# Altium project SynchronousRectifier.PrjPcb
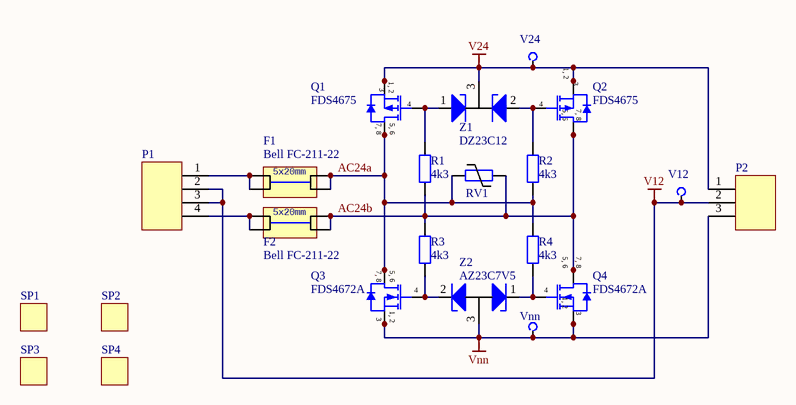
[diagram p0: SynchronousRectifier.SchDoc]
Version: 1.0
1 sheet, 22 parts. Net scope: global (net labels, ports and power ports of the same name join across sheets).
Board file: SynchronousRectifier_ASCII.PcbDoc

## Sheet SynchronousRectifier.SchDoc
size A; SheetNumber: 1; SheetTotal: 1

### Parts
F1  Bell FC-211-22  [FUSE_CLIP_5x20]
F2  Bell FC-211-22  [FUSE_CLIP_5x20]
P1  Terminal4_5.08mm  [MOLEX-39544-3004]  (value not drawn)
P2  Terminal3_5.08mm  [MOLEX-39544-3003]  (value not drawn)
Q1  FDS4675  [SO-8_M]
Q2  FDS4675  [SO-8_M]
Q3  FDS4672A  [SO-8_M]
Q4  FDS4672A  [SO-8_M]
R1  4k3  [CR1608-0603_N]
R2  4k3  [CR1608-0603_N]
R3  4k3  [CR1608-0603_N]
R4  4k3  [CR1608-0603_N]
RV1  V33MLA1206NHAUTO  [VR3216-1206]  (value not drawn)
SP1  Spacer-3mm-tapped x 10mm  [Spacer-3mm tapped x 10 mm]  (value not drawn)
SP2  Spacer-3mm-tapped x 10mm  [Spacer-3mm tapped x 10 mm]  (value not drawn)
SP3  Spacer-3mm-tapped x 10mm  [Spacer-3mm tapped x 10 mm]  (value not drawn)
SP4  Spacer-3mm-tapped x 10mm  [Spacer-3mm tapped x 10 mm]  (value not drawn)
V12  Power 12V FWR  [PCBPIN - 0.7mm]  (value not drawn)  (no BOM)
V24  Power 24V FWR  [PCBPIN - 0.7mm]  (value not drawn)  (no BOM)
Vnn  Power Ground  [PCBPIN - 0.7mm]  (value not drawn)  (no BOM)
Z1  DZ23C12  [SOT23_M]
Z2  AZ23C7V5  [SOT23_M]

### Nets
V12: P1.2 P1.3 P2.2 V12.1(TP)
V24: P2.1 Q1.1(S) Q1.2(S) Q1.3(S) Q2.1(S) Q2.2(S) Q2.3(S) V24.1(TP) Z1.3(K)
Vnn: P2.3 Q3.1(S) Q3.2(S) Q3.3(S) Q4.1(S) Q4.2(S) Q4.3(S) Vnn.1(TP) Z2.3(K)
AC24a: F1.2 F1.2a Q1.5(D) Q1.6(D) Q1.7(D) Q1.8(D) Q3.5(D) Q3.6(D) Q3.7(D) Q3.8(D) R2.1 R4.2 RV1.2
AC24b: F2.2 F2.2a Q2.5(D) Q2.6(D) Q2.7(D) Q2.8(D) Q4.5(D) Q4.6(D) Q4.7(D) Q4.8(D) R1.1 R3.2 RV1.1
NetF1_1: F1.1 F1.1a P1.1
NetF2_1: F2.1 F2.1a P1.4
NetQ1_4: Q1.4(G) R1.2 Z1.1(A1)
NetQ2_4: Q2.4(G) R2.2 Z1.2(A2)
NetQ3_4: Q3.4(G) R3.1 Z2.2(A2)
NetQ4_4: Q4.4(G) R4.1 Z2.1(A1)

### Notes on the sheet
- (in symbol FDS4672A) 7, 8; 5, 6; 1, 2
- (in symbol FDS4675) 1, 2; 7, 8; 5, 6
- (in symbol FUSE_CLIP_5x20) 5x20mm

### Library data of the parts
F1 F2 = FUSE_CLIP_5x20: 5x20mm fuse clip PCB Mount; Value: 10 A; Digikey: 507-1415-ND
P1 = Terminal4_5.08mm: MULTICOMP MC24368 TERMINAL BLOCK EUROSTYLE, 4 POSITION, 26-12AWG, 5.08mm; Farnell PN: 1624302; LCSC: *
P2 = Terminal3_5.08mm: MULTICOMP MC24367 TERMINAL BLOCK EUROSTYLE, 3 POSITION, 26-12AWG, 5.08mm; Farnell PN: *; LCSC: *
Q1 Q2 = FDS4675: P-Channel Power MOSFET, 11 A, 40 V, RDS(ON) = 0.013 ohm @ VGS = -10   VRDS(ON) = 0.017 ohm @ VGS =   -4.5 VC; Manufacturer: Fairchild Semiconductor; Package Version: Rev. 16, 08/2015; Qg Gate Charge: 56nC; Drain-to-Source Voltage [Vdss]: 40V; Drain-Source On Resistance-Max: 13mO; Rated Power Dissipation: 2.4W; Datasheet Version: Rev. C(W), 02/2001; Package Description: 8-Pin Small Outline Integrated Circuit, Body 4.9 x 3.9 mm, Pitch 1.27 mm; Channel Type: P-Channel; Datasheet URL: https://www.fairchildsemi.com/datasheets/FD/FDS4675.pdf; Package URL: https://www.fairchildsemi.com/package-drawings/M0/M08A.pdf; Package Reference: SO-8; Mounting Technology: SurfaceMount; Manufacturer URL: https://www.fairchildsemi.com/; Temperature: 25
Q3 Q4 = FDS4672A: N-Channel Power MOSFET, 11 A, 40 V. RDS(ON)  = .013 ohm @ VGS = 4.5 V; Manufacturer: Fairchild Semiconductor; Package Version: Rev. 16, 08/2015; Channel Type: P-Channel; Qg Gate Charge: 56nC; Drain-to-Source Voltage [Vdss]: 40V; Drain-Source On Resistance-Max: 13mO; Rated Power Dissipation: 2.4W; Datasheet Version: Rev. C(W), 02/2001; Package Description: 8-Pin Small Outline Integrated Circuit, Body 4.9 x 3.9 mm, Pitch 1.27 mm; Datasheet URL: https://www.fairchildsemi.com/datasheets/FD/FDS4675.pdf; Package URL: https://www.fairchildsemi.com/package-drawings/M0/M08A.pdf; Package Reference: SO-8; Mounting Technology: SurfaceMount; Manufacturer URL: https://www.fairchildsemi.com/; LCSC: C725034
R1-R4 = Res_CR0603: Resistor SMT 0603; Manufacturer: Generic Components; Class: Passive; Published: 08/06/2000; Publisher: Altium Hobart Technology Centre; SubClass: Resistor; Farnell PN: *; Digikey: *; LCSC: C23159; Value: 4k3
RV1 = V33MLA1206NHAUTO: V33MLA1206NH - TVS Varistor, 26 V, 33 V, MLA Series, 75 V, 1206 [3216 Metric], Multilayer Varistor (MLV); Manufacturer: Generic Components; Class: Passive; SubClass: Resistor; Published: 08/06/2000; Publisher: Altium Hobart Technology Centre; Farnell PN: 1816942; Digikey: F11298CT-ND; LCSC: *
SP1-SP4 = Spacer-3mm-tapped x 10mm: 6MM Spacer
V12 V24 Vnn = TP: Test Point; Digikey: *; Farnell PN: *; LCSC: *
Z1 = DZ23Cxx: Dual silicon planar Zener diodes; Digikey: *; Farnell PN: *; LCSC: *
Z2 = AZ23Cxx: Dual silicon planar Zener diodes; Digikey: *; Farnell PN: *; LCSC: *